# EAGLE board VideoBoy1.12 (EAGLE 8.2.2)
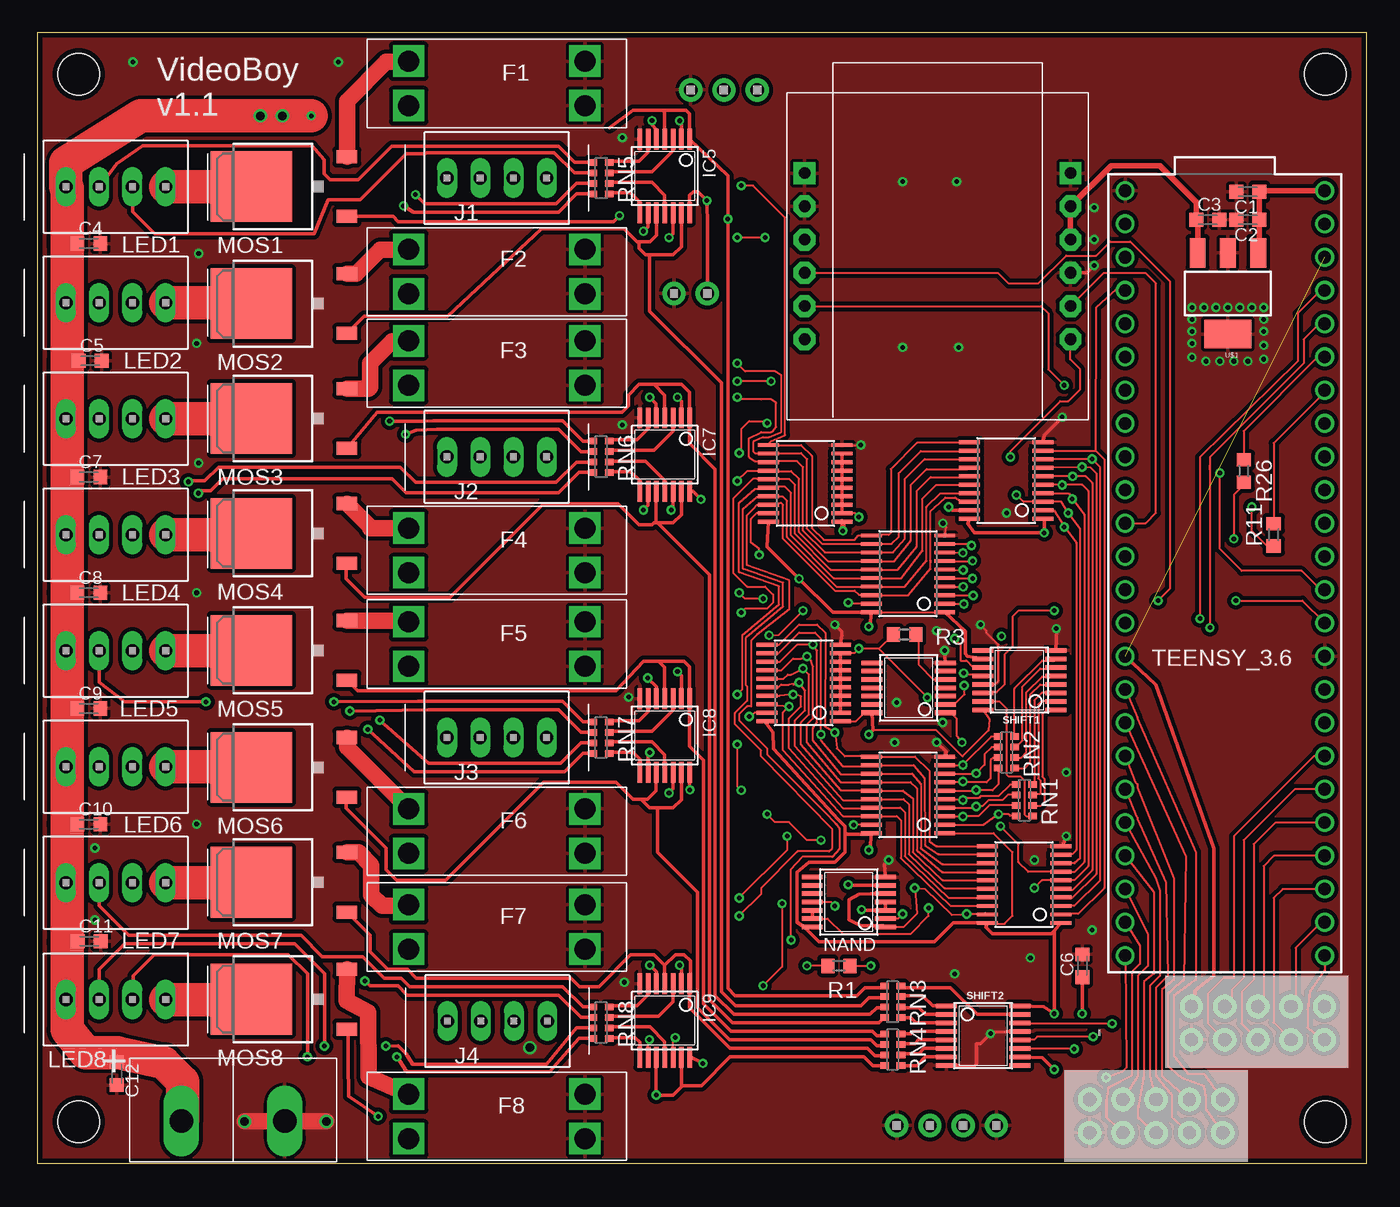
[diagram p2: board, top side]
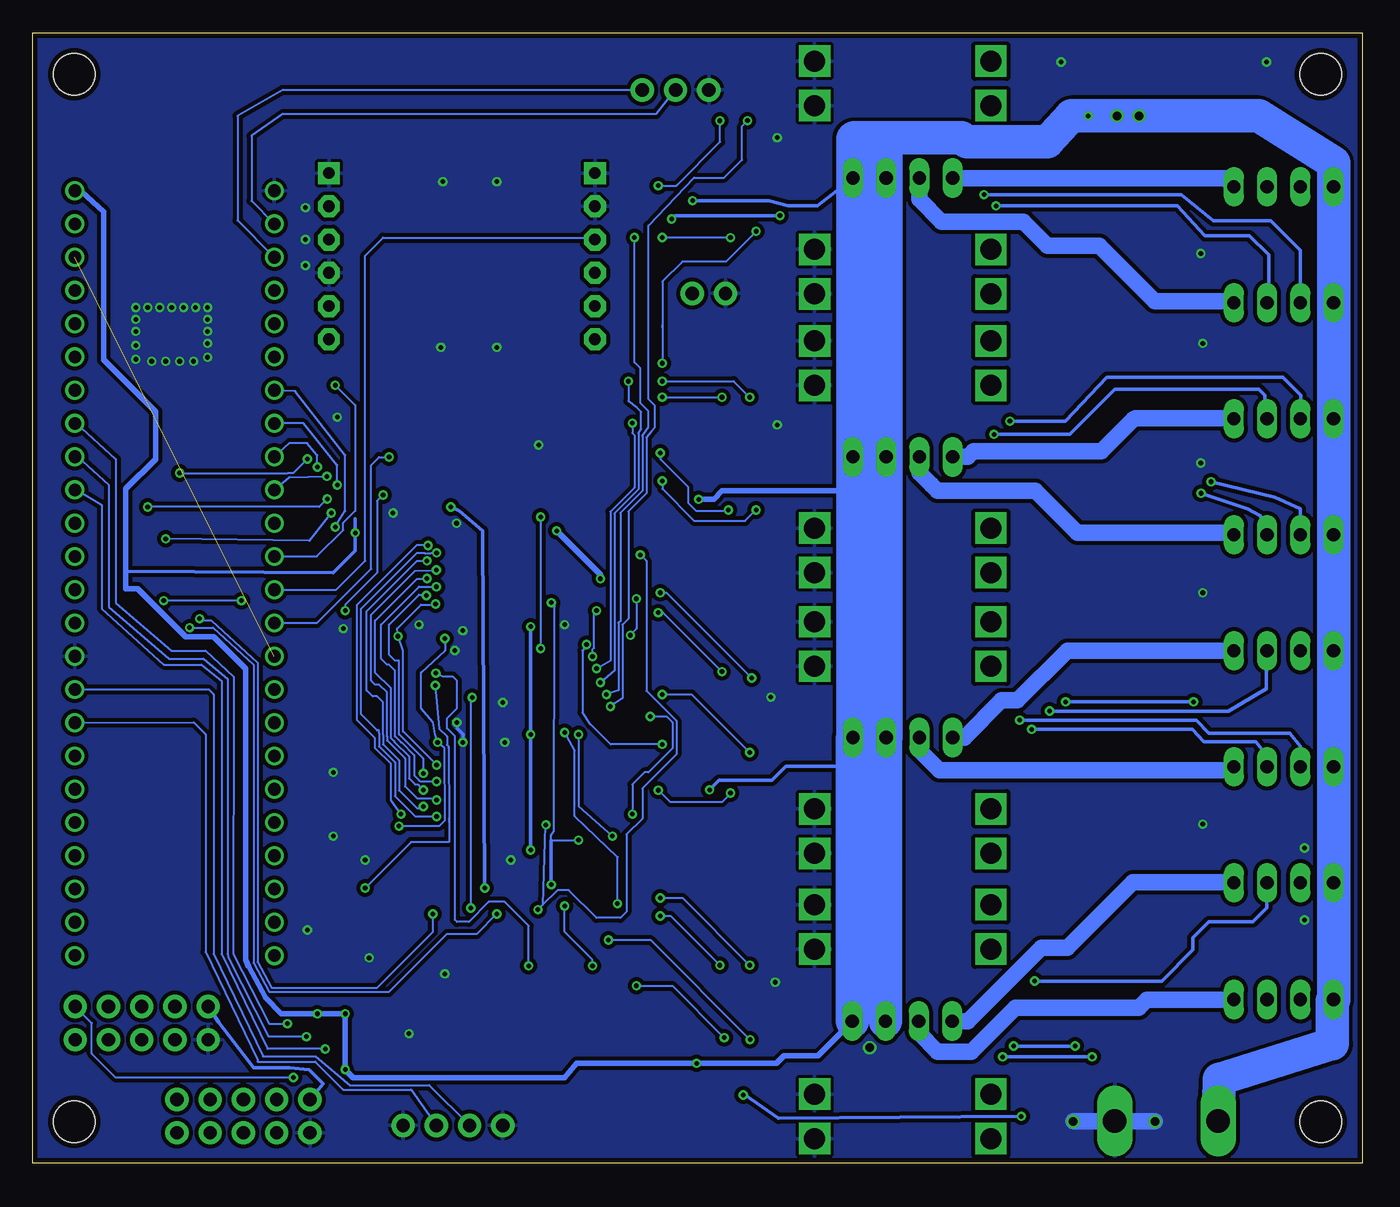
[diagram p3: board, bottom side, seen from below]

Size 101.6 x 86.36 mm. Coordinates in mm from the lower left corner, seen from the top.
Outline: 0,0 101.6,0 101.6,86.36 0,86.36 0,0
Copper layers (1*16): Top 0.0356mm / dielectric 1.5011mm / Bottom 0.0356mm
Design rules "oshpark-2layer": minimum track width 6mil, minimum drill 13mil, track to track 6mil, track to pad 6mil, pad to pad 6mil, via to via 6mil, smd to smd 6mil, copper to edge 15mil, drill to drill 6mil, minimum pad ring 7mil, minimum via ring 7mil, stop-mask expansion 2.5mil, vias tented up to drill 0mil, thermal gap 10mil
Holes 3.2 mm at 3.17,3.17 3.17,83.19 98.42,83.19 98.42,3.17

## Footprints (pad centres in the part's own frame; a part is rotated, then mirrored left to right if it is on the bottom)
C0603K = smd 1.05 x 1.08: 1 -0.875,0; 2 0.875,0
TSSOP20 = smd 0.3 x 1.6: 1 -2.925,-2.8; 2 -2.275,-2.8; 3 -1.625,-2.8; 4 -0.975,-2.8; 5 -0.325,-2.8; 6 0.325,-2.8; 7 0.975,-2.8; 8 1.625,-2.8; 9 2.275,-2.8; 10 2.925,-2.8; 11 2.925,2.8; 12 2.275,2.8; 13 1.625,2.8; 14 0.975,2.8; 15 0.325,2.8; 16 -0.325,2.8; 17 -0.975,2.8; 18 -1.625,2.8; 19 -2.275,2.8; 20 -2.925,2.8
3557 = drill 1.6 square: 1 -6.735,1.7; 2 -6.735,-1.7; 3 6.735,1.7; 4 6.735,-1.7
1X4 = drill 1.016 pad 1.778: 1 0,0; 2 2.54,0; 3 5.08,0; 4 7.62,0
1X3 = drill 1.016 pad 1.778: 1 0,0; 2 2.54,0; 3 5.08,0
1X2 = drill 1.016 pad 1.778: 1 0,0; 2 2.54,0
TSSOP14 = smd 0.35 x 1.6: 1 -1.905,-2.8; 2 -1.27,-2.8; 3 -0.635,-2.8; 4 0,-2.8; 5 0.635,-2.8; 6 1.27,-2.8; 7 1.905,-2.8; 8 1.905,2.8; 9 1.27,2.8; 10 0.635,2.8; 11 0,2.8; 12 -0.635,2.8; 13 -1.27,2.8; 14 -1.905,2.8
BOARDMOUNT-LED = drill 1.016 long: 1 3.81,0; 2 1.27,0; 3 -1.27,0; 4 -3.81,0
POWERPOLE_PAIR_25A = drill 1.8 long: BLACK 3.95,-0.85; RED -3.95,-0.85
2X5 = drill 1.016 pad 1.778: 1 0,0; 2 0,2.54; 3 2.54,0; 4 2.54,2.54; 5 5.08,0; 6 5.08,2.54; 7 7.62,0; 8 7.62,2.54; 9 10.16,0; 10 10.16,2.54
TO-252 = smd 1 x 1.6: 1 -2.28,-4.8; 2 2.28,-4.8 | smd 5.4 x 6.2: 3 0,2.5
R0603 = smd 1 x 1.1: 1 -0.85,0; 2 0.85,0
0603-ARV = smd 0.5 x 0.65: 1 -1.2,-0.625; 2 -0.4,-0.625; 3 0.4,-0.625; 4 1.2,-0.625; 5 1.2,0.625; 6 0.4,0.625; 7 -0.4,0.625; 8 -1.2,0.625
TSSOP16 = smd 0.35 x 1.6: 1 -2.275,-2.8; 2 -1.625,-2.8; 3 -0.975,-2.8; 4 -0.325,-2.8; 5 0.325,-2.8; 6 0.975,-2.8; 7 1.625,-2.8; 8 2.275,-2.8; 9 2.275,2.8; 10 1.625,2.8; 11 0.975,2.8; 12 0.325,2.8; 13 -0.325,2.8; 14 -0.975,2.8; 15 -1.625,2.8; 16 -2.275,2.8
TEENSY_3.5_DIL = drill 0.965: 0 -7.62,26.67; 1 -7.62,24.13; 2 -7.62,21.59; 3 -7.62,19.05; 3.3V 7.62,24.13; 3.3V3 -7.62,-6.35; 4 -7.62,16.51; 5 -7.62,13.97; 6 -7.62,11.43; 7 -7.62,8.89; 8 -7.62,6.35; 9 -7.62,3.81; 10 -7.62,1.27; 11 -7.62,-1.27; 12 -7.62,-3.81; 13 7.62,-3.81; 14/A0 7.62,-1.27; 15/A1 7.62,1.27; 16/A2 7.62,3.81; 17/A3 7.62,6.35; 18/A4 7.62,8.89; 19/A5 7.62,11.43; 20/A6 7.62,13.97; 21/A7 7.62,16.51; 22/A8 7.62,19.05; 23/A9 7.62,21.59; 24 -7.62,-8.89; 25 -7.62,-11.43; 26 -7.62,-13.97; 27 -7.62,-16.51; 28 -7.62,-19.05; 29 -7.62,-21.59; 30 -7.62,-24.13; 31/A12 -7.62,-26.67; 32/A13 -7.62,-29.21; 33/A14 7.62,-29.21; 34/A15 7.62,-26.67; 35/A16 7.62,-24.13; 36/A17 7.62,-21.59; 37/A18 7.62,-19.05; 38/A19 7.62,-16.51; 39/A20 7.62,-13.97; A21 7.62,-11.43; A22 7.62,-8.89; AGND 7.62,26.67; GND -7.62,29.21; GND1 7.62,-6.35; VIN 7.62,29.21
SOT223 = smd 1.219 x 2.235: 1 -2.311,-3.099; 2 0,-3.099; 3 2.311,-3.099 | smd 3.6 x 2.2: 4 0,3.099
WIZ820IO = drill 0.9 pad 1.676 square: J1.1 -10.16,6.35; J2.1 10.16,6.35 | drill 0.9 pad 1.676 octagon: J1.2 -10.16,3.81; J1.3 -10.16,1.27; J1.4 -10.16,-1.27; J1.5 -10.16,-3.81; J1.6 -10.16,-6.35; J2.2 10.16,3.81; J2.3 10.16,1.27; J2.4 10.16,-1.27; J2.5 10.16,-3.81; J2.6 10.16,-6.35

## Placement (x,y rotation side)
C1  [C0603K]  92.51,74.22 180 top
C2  [C0603K]  92.51,72.09 180 top
C3  [C0603K]  89.46,72.09 0 top
C4  [C0603K]  3.96,70.26 0 top
C5  [C0603K]  4.06,61.32 0 top
C6  [C0603K]  79.86,15.09 90 top
C7  [C0603K]  3.96,52.43 0 top
C8  [C0603K]  3.96,43.59 0 top
C9  [C0603K]  3.96,34.75 0 top
C10  [C0603K]  3.96,25.91 0 top
C11  [C0603K]  3.99,16.97 0 top
C12  [C0603K]  6.1,6.86 270 top
CLK-CLK  74245  [TSSOP20]  58.7,51.94 90 top
CLK-DATA  74245  [TSSOP20]  58.57,36.7 90 top
DATA-CLK  74245  [TSSOP20]  66.55,45.03 90 top
DATA-DATA  74245  [TSSOP20]  66.55,28.14 90 top
F1  FUSE_3557NOPIN2  [3557]  35.12,82.49 0 top
F2  FUSE_3557NOPIN2  [3557]  35.12,68.11 0 top
F3  FUSE_3557NOPIN2  [3557]  35.12,61.12 0 top
F4  FUSE_3557NOPIN2  [3557]  35.12,46.82 0 top
F5  FUSE_3557NOPIN2  [3557]  35.12,39.67 0 top
F6  FUSE_3557NOPIN2  [3557]  35.12,25.37 0 top
F7  FUSE_3557NOPIN2  [3557]  35.12,18.06 0 top
F8  FUSE_3557NOPIN2  [3557]  35.12,3.6 0 top
H1  1X4  [1X4]  73.3,2.9 180 top
H2  1X3  [1X3]  55.02,81.99 180 top
H3  1X2  [1X2]  51.21,66.45 180 top
IC5  74126PW  [TSSOP14]  47.96,75.42 180 top
IC6  74393AT-PWRQ1  [TSSOP14]  66.6,36.32 90 top
IC7  74126PW  [TSSOP14]  47.96,54.13 180 top
IC8  74126PW  [TSSOP14]  47.96,32.68 180 top
IC9  74126PW  [TSSOP14]  47.96,10.91 180 top
J1  [BOARDMOUNT-LED]  35.12,75.26 0 top
J2  [BOARDMOUNT-LED]  35.12,53.97 0 top
J3  [BOARDMOUNT-LED]  35.12,32.52 0 top
J4  [BOARDMOUNT-LED]  35.17,10.86 0 top
J5  POWERPOLE_POWER25A  [POWERPOLE_PAIR_25A]  14.97,4.08 0 top
JP1  2X5  [2X5]  90.58,4.88 180 top
JP2  2X5  [2X5]  98.35,11.99 180 top
LED1  [BOARDMOUNT-LED]  6.02,74.6 180 top
LED2  [BOARDMOUNT-LED]  6.02,65.74 180 top
LED3  [BOARDMOUNT-LED]  6.02,56.88 180 top
LED4  [BOARDMOUNT-LED]  6.02,48.02 180 top
LED5  [BOARDMOUNT-LED]  6.02,39.16 180 top
LED6  [BOARDMOUNT-LED]  6.02,30.3 180 top
LED7  [BOARDMOUNT-LED]  6.02,21.44 180 top
LED8  [BOARDMOUNT-LED]  6.02,12.52 180 top
MOS1  N-CHANNEL_MOSFET_TO-252  [TO-252]  18.87,74.61 90 top
MOS2  N-CHANNEL_MOSFET_TO-252  [TO-252]  18.87,65.67 90 top
MOS3  N-CHANNEL_MOSFET_TO-252  [TO-252]  18.87,56.9 90 top
MOS4  N-CHANNEL_MOSFET_TO-252  [TO-252]  18.87,48.12 90 top
MOS5  N-CHANNEL_MOSFET_TO-252  [TO-252]  18.87,39.18 90 top
MOS6  N-CHANNEL_MOSFET_TO-252  [TO-252]  18.87,30.25 90 top
MOS7  N-CHANNEL_MOSFET_TO-252  [TO-252]  18.87,21.47 90 top
MOS8  N-CHANNEL_MOSFET_TO-252  [TO-252]  18.87,12.53 90 top
NAND  74HC00PW  [TSSOP14]  62.03,19.96 90 top
OCTOCLK  74245  [TSSOP20]  74.04,52.15 90 top
OCTODATA  74245  [TSSOP20]  75.41,21.29 90 top
R1  30  [R0603]  61.26,15.09 0 top
R3  30  [R0603]  66.29,40.39 0 top
R11  30  [R0603]  94.49,48.01 90 top
R26  [R0603]  92.2,52.88 270 top
RN1  [0603-ARV]  75.44,27.74 90 top
RN2  [0603-ARV]  74.07,31.39 90 top
RN3  [0603-ARV]  65.38,12.34 90 top
RN4  [0603-ARV]  65.38,8.69 90 top
RN5  [0603-ARV]  43.08,75.26 90 top
RN6  [0603-ARV]  43.08,53.97 90 top
RN7  [0603-ARV]  43.08,32.52 90 top
RN8  [0603-ARV]  43.08,10.75 90 top
SHIFT1  [TSSOP16]  75.06,36.91 90 top
SHIFT2  [TSSOP16]  72.29,9.75 270 top
TEENSY_3.6  TEENSY_3.5_DIL  [TEENSY_3.5_DIL]  90.75,45.09 0 top
U$1  3.3VREGMCP1825  [SOT223]  90.98,66.45 180 top
WIZNET820IO  [WIZ820IO]  68.81,69.29 0 top

## Tracks (layer width: path | path; a pad name or v marks a point on that pad's centre or on a via)
20_OUT
  Top 0.152: TEENSY_3.6.20/A6 98.37,58.9 94.49,55.02 R11.2
21_OUT
  Top 0.152: TEENSY_3.6.21/A7 97.87,61.6 92.2,55.93 R26.1
24
  Top 0.152: TEENSY_3.6.24 84.06,34.08 84.09,34.05 84.09,34.01 88.54,23.77 88.54,14.02 86.87,12.8 86.87,8.23 87.94,6.86 89.15,6.86 JP1.1
25
  Top 0.152: TEENSY_3.6.25 87.78,23.47 87.63,14.02 86.41,12.95 86.41,7.47 87.48,6.55 89.15,5.94 89.31,5.03 89.31,4.11 JP1.2
26
  Top 0.152: TEENSY_3.6.26 83.93,29.13 84.09,28.97 84.09,28.74 86.87,21.79 86.87,14.02 85.95,13.26 85.95,6.71 JP1.3
27
  Top 0.152: TEENSY_3.6.27 84,26.52 84.09,26.43 84.09,26.3 86.26,21.49 86.41,14.33 85.5,13.41 85.5,6.71 86.49,5.46 86.61,5.34 86.61,5.31 86.72,5.18 86.72,3.51 JP1.4
28
  Top 0.152: TEENSY_3.6.28 85.5,21.79 85.8,20.88 85.8,14.33 85.04,13.56 85.04,6.71 JP1.5
29
  Top 0.152: TEENSY_3.6.29 85.34,20.73 85.34,14.48 84.58,13.87 84.58,6.71 84.12,4.11 84.12,3.51 JP1.6
30
  Top 0.152: TEENSY_3.6.30 84.89,17.53 84.89,15.09 84.12,14.33 84.12,6.71 JP1.7
31
  Top 0.152: TEENSY_3.6.31/A12 84.28,16.61 84.28,15.24 83.67,14.63 83.67,6.71 81.84,5.79 81.69,4.88 81.69,3.51 JP1.8
32  (via drill 0.35)
  Top 0.152: TEENSY_3.6.32/A13 83.21,7.32 82.91,7.01 v81.69,6.55
  Bottom 0.152: v81.69,6.55 95.25,6.55 97.08,8.38 97.08,10.72 JP2.1
33
  Top 0.152: TEENSY_3.6.33/A14 98.37,14.78 | 98.37,14.78 98.37,14.71 | 98.37,14.78 97.23,13.11 97.08,11.73 97.08,10.36 JP2.2
33REG
  Top 0.406: WIZNET820IO.J2.3 WIZNET820IO.J2.2 82.07,76.2 85.8,76.2 88.58,73.42 C3.1 88.67,72 U$1.3
34
  Top 0.152: TEENSY_3.6.34/A15 98.12,18.42 96.16,16.46 96.16,12.34 JP2.3
35
  Top 0.152: TEENSY_3.6.35/A16 95.17,20.96 94.49,20.27 94.49,10.77 JP2.4
36
  Top 0.152: TEENSY_3.6.36/A17 94.51,23.5 93.73,22.71 93.73,12.45 JP2.5
37
  Top 0.152: TEENSY_3.6.37/A18 94.61,26.04 92.96,24.38 92.96,14.02 92.05,13.11 92.05,10.67 JP2.6
38
  Top 0.152: TEENSY_3.6.38/A19 96.09,28.58 92.2,24.69 92.2,14.17 91.29,13.26 91.29,12.55 JP2.7
39
  Top 0.152: TEENSY_3.6.39/A20 97.56,31.12 91.44,24.99 91.44,14.17 90.68,14.17 89.46,12.95 89.46,10.72 JP2.8
+3V3  (1 unrouted)
  Top 0.254: TEENSY_3.6.3.3V3 85.5,36.58 89.92,24.08 89.92,14.33 88.54,13.26 JP2.9
  Bottom 0.254: JP1.9 79.4,6.1 80.47,7.16 81.97,7.32 84.73,7.32 87.4,10.8 JP2.9
C1  (via drill 0.35)
  Top 0.152: 55.79,54.86 58.37,54.86 59.19,54.04 59.19,48.53 60.11,47.61 62.48,47.61 62.72,47.96 62.73,47.96 DATA-CLK.11 63.68,48.01 65.08,48.01 65.23,48.16 65.23,53.04 67.26,55.07 OCTOCLK.11 | 55.79,54.86 56.08,55.16 57.15,55.63 57.15,72.24 54.71,74.68 v53.8,74.68 | CLK-CLK.11 55.79,54.86
  Top 0.254: IC5.2 49.23,79.35 v49.09,79.64
  Bottom 0.152: v53.8,74.68 52.43,74.68 49.07,78.03 49.07,79.46 v49.09,79.64
C2  (via drill 0.35)
  Top 0.152: 55.82,54.25 58.37,54.25 58.83,53.8 58.83,48.46 59.98,47.31 DATA-CLK.12 65.29,47.31 65.84,47.85 65.84,52.73 67.51,54.41 71.11,54.41 OCTOCLK.12 | 55.82,54.25 CLK-CLK.12 | 55.82,54.25 54.86,54.25 54.71,54.41 54.71,55.12 54.76,55.17 55.47,55.47 55.93,55.47 56.82,55.83 56.84,60.2 56.39,60.5 54.1,60.5 v53.49,61.11
  Top 0.254: IC5.9 46.69,71.55 v46.33,71.2
  Bottom 0.152: 53.49,63.85 v53.49,61.11 | 53.49,63.85 53.49,64.04 | v46.33,71.2 46.33,71.17 48.62,68.88 51.97,68.88 53.49,67.36 53.49,63.85
C3  (via drill 0.35)
  Top 0.152: OCTOCLK.13 71.1,53.8 67.82,53.8 66.29,52.27 66.29,47.7 65.4,46.66 DATA-CLK.13 60.2,46.66 58.52,48.34 58.52,53.19 58.06,53.64 55.86,53.64 CLK-CLK.13 55.7,53.64 54.86,53.64 54.41,53.95 54.41,55.4 55.35,55.85 56.06,55.85 56.22,55.92 56.46,56.24 56.46,58.09 56.08,58.37 55.33,58.37 55.33,58.36 55.32,58.37 53.65,58.37 v53.49,58.52
  Top 0.254: IC7.2 49.23,58.23 v48.93,58.52
  Bottom 0.152: v53.49,58.52 v48.93,58.52
C4  (via drill 0.35)
  Top 0.152: 55.75,52.88 CLK-CLK.14 55.82,52.88 | 55.82,52.88 57.61,52.88 58.22,52.27 58.22,48.21 60.42,46.01 DATA-CLK.14 65.52,46.01 66.75,47.55 66.75,51.82 67.97,53.04 71.04,53.04 OCTOCLK.14 | v53.49,52.12 54.25,52.88 55.82,52.88
  Top 0.254: IC7.9 46.69,50.26 v46.33,49.91
  Bottom 0.152: v53.49,52.12 53.49,51.51 51.05,49.07 47.17,49.07 v46.33,49.91
C5  (via drill 0.35)
  Top 0.152: CLK-CLK.15 55.78,52.27 55.17,52.27 55.02,52.27 54.71,52.27 53.19,50.75 53.19,45.11 54.25,44.04 55.63,44.04 56.24,43.43 56.24,42.82 55.78,42.37 54.1,42.37 v53.8,42.06 | 55.79,52.27 CLK-CLK.15 57.45,52.27 57.91,51.82 57.91,48.08 60.64,45.36 DATA-CLK.15 65.78,45.36 67.21,47.09 67.21,51.36 68.28,52.43 71.08,52.43 OCTOCLK.15
  Top 0.254: 55.17,52.27 CLK-CLK.15 | IC8.2 49.23,37.26 v48.93,37.56
  Bottom 0.152: v53.8,42.06 53.44,42.06 v48.93,37.56
C6  (via drill 0.35)
  Top 0.152: OCTOCLK.16 71.12,51.82 68.73,51.82 67.67,50.77 67.67,46.79 66.05,44.71 DATA-CLK.16 60.86,44.71 57.61,47.96 57.61,51.21 57.15,51.66 55.83,51.66 CLK-CLK.16 55.68,51.51 54.86,51.51 53.65,50.44 53.65,45.14 56.69,44.07 56.69,42.67 53.86,40.3 53.86,36.19 v53.49,35.81
  Top 0.254: IC8.9 46.69,31.25 v46.82,31.38
  Bottom 0.152: v53.49,35.81 51.25,35.81 v46.82,31.38
C7  (via drill 0.35)
  Top 0.152: OCTOCLK.17 69.04,51.18 67.97,50.14 67.97,46.02 66.31,44.06 DATA-CLK.17 61.08,44.06 57.3,47.83 57.3,50.6 57,50.9 55.85,50.9 CLK-CLK.17 55.72,50.9 55.02,50.9 53.95,49.99 53.95,45.42 57,44.35 57,42.52 54.17,40.15 54.17,36.52 54.25,36.43 54.25,35.33 53.34,34.42 53.34,33.53 55.32,31.55 55.32,31.09 60.76,25.5 60.76,24.08 60.5,23.83 58.12,23.83 55.32,21.03 55.32,20.57 v53.65,18.9
  Top 0.254: IC9.2 49.23,15 v49.09,15.13
  Bottom 0.152: v53.65,18.9 52.86,18.9 v49.09,15.13
C8  (via drill 0.35)
  Top 0.152: CLK-CLK.18 55.76,50.29 55.02,50.29 54.7,49.98 54.25,49.52 54.25,45.69 57.48,44.53 57.48,42.34 55.01,40.38 54.56,39.93 54.56,34.9 54.25,34.9 53.65,34.29 53.65,33.83 55.78,31.7 55.78,31.24 60.34,26.68 60.84,26.14 60.94,26.04 61.03,25.94 61.04,25.94 61.29,25.56 61.29,24.03 60.76,23.42 58.48,23.42 57.58,22.42 57.58,17.09 v57.61,17.07 | 55.81,50.29 CLK-CLK.18 | 68.59,50.13 68.28,49.82 68.28,46.04 68.28,45.92 68.28,45.91 68.28,45.42 66.57,43.41 DATA-CLK.18 63.61,43.43 62.79,43.43 62.47,43.75 60.95,43.75 57,47.71 57,50.29 56.84,50.44 56.54,50.29 CLK-CLK.18 | 68.59,50.13 | 68.59,50.13 69.39,50.85 70.15,50.85 70.56,50.6 71.05,50.6 OCTOCLK.18 | IC9.9 46.69,9.35 v46.79,9.45
  Bottom 0.152: v57.61,17.07 54.41,17.07 v46.79,9.45
COUT_1
  Top 0.254: RN5.6 41.06,75.66 39.51,77.21 29.76,77.21 29.66,77.11 28.19,77.11 24.69,73.61 22.25,73.61 21.18,71.02 8.99,71.02 7.32,72.69 7.32,74.57 LED1.3
COUT_2  (via drill 0.35)
  Top 0.254: v28,73.14 28.78,72.66 39.83,72.66 41.23,74.06 RN5.8
  Bottom 0.254: v28,73.14 14.16,73.14 12.05,70.87 8.63,70.87 7.17,69.41 7.17,65.85 LED2.3
COUT_3  (via drill 0.35)
  Top 0.254: v28.15,55.69 28.96,55.99 30.57,56.08 39.83,56.08 41.55,54.37 RN6.6
  Bottom 0.254: v28.15,55.69 22.34,55.69 18.9,59.13 7.92,59.13 7.47,58.67 7.47,57.06 LED3.3
COUT_4  (via drill 0.35)
  Top 0.254: RN6.8 41.4,52.77 39.83,51.21 28.19,51.21 27.13,52.27 14.17,52.27 13.26,51.36 12.5,51.36 v12.33,51.19
  Bottom 0.254: v12.33,51.19 8.8,50.02 7.79,49.46 7.33,48.06 LED4.3
COUT_5  (via drill 0.35)
  Top 0.254: RN7.6 41.55,32.92 39.83,34.63 29.92,34.63 v23.9,34.55
  Bottom 0.254: v23.9,34.55 10.26,34.55 7.33,36.26 7.33,39.11 LED5.3
COUT_6  (via drill 0.35)
  Top 0.254: RN7.8 41.72,31.32 40.32,29.92 28.8,29.92 v25.27,33.15
  Bottom 0.254: v25.27,33.15 12.99,33.15 12.11,32.21 8.16,32.21 7.33,31.22 7.33,30.34 LED6.3
COUT_7  (via drill 0.35)
  Top 0.254: RN8.6 41.55,11.15 39.83,12.86 28.29,12.86 27.58,13.56 25.45,13.56 v25.04,13.92
  Bottom 0.254: LED7.3 7.32,21.41 7.32,19.51 8.38,18.44 11.73,18.44 12.95,17.22 12.95,16.31 15.34,13.92 v25.04,13.92
COUT_8  (via drill 0.35)
  Top 0.254: RN8.8 41.4,9.55 39.16,7.01 28.22,7.01 v27.49,8.14 | v20.66,8.14 20.66,14.48 19.2,15.95 8.96,15.95 7.33,14.32 7.33,12.56 LED8.3
  Bottom 0.254: v27.49,8.14 v20.66,8.14
CROUT9
  Top 0.254: IC5.3 48.59,77.36 46.98,75.75 43.8,75.75 RN5.3
CROUT10
  Top 0.254: IC5.8 46.05,73.43 45.36,74.12 43.77,74.12 RN5.1
CROUT11
  Top 0.254: IC7.3 48.59,55.91 47.15,54.46 43.8,54.46 RN6.3
CROUT12
  Top 0.254: IC7.8 46.05,52.14 45.36,52.83 43.77,52.83 RN6.1
CROUT13
  Top 0.254: IC9.3 48.59,12.36 47.47,11.23 43.8,11.23 RN8.3
CROUT14
  Top 0.254: IC8.8 46.05,30.85 45.52,31.38 43.77,31.38 RN7.1
CROUT15
  Top 0.254: IC9.8 46.05,9.24 45.68,9.61 43.77,9.61 RN8.1
CROUT16
  Top 0.254: IC8.3 48.59,34.62 46.98,33.01 43.8,33.01 RN7.3
D1  (via drill 0.35)
  Top 0.152: OCTODATA.18 72.49,19.66 69.8,19.66 65.99,23.32 65.99,26.21 65.68,26.52 DATA-DATA.18 63.63,26.52 61.57,26.52 57,31.55 57,34.44 v57.45,34.9 CLK-DATA.18
  Top 0.254: v46.98,79.65 46.98,79.32 47.31,79 47.31,78.24 IC5.5
  Bottom 0.152: v57.45,34.9 56.54,35.51 56.54,41.15 56.08,41.61 56.08,49.81 54.71,51.18 54.71,55.45 | 54.71,55.45 54.36,55.88 54.05,56.24 54.05,57.86 54.56,58.37 54.56,71.63 51.05,75.29 48.77,75.29 47.4,76.66 47.4,79.23 v46.98,79.65 | 54.71,55.45
D2  (via drill 0.35)
  Top 0.152: OCTODATA.17 72.45,20.27 69.65,20.27 66.29,23.47 66.29,26.82 65.95,27.17 DATA-DATA.17 63.59,27.13 61.57,27.13 57.45,31.7 57.45,33.99 58.37,34.9 58.37,35.66 v57.76,35.81 56.76,35.73 CLK-DATA.17 | v55.63,70.71 v53.49,70.71
  Top 0.254: IC5.12 48.59,71.02 v48.28,70.71
  Bottom 0.152: v57.76,35.81 56.84,36.12 56.84,41.27 56.69,41.43 56.69,49.68 55.02,51.36 55.02,55.57 54.56,56.24 54.56,57.45 54.58,57.48 55.17,58.06 55.17,60.72 55.63,61.17 v55.63,70.71 | v48.28,70.71 v53.49,70.71
D3  (via drill 0.35)
  Top 0.152: OCTODATA.16 72.42,21.03 69.34,21.03 66.6,23.62 66.6,27.43 66.21,27.82 DATA-DATA.16 63.55,27.74 61.57,27.74 57.91,31.85 57.91,33.83 58.67,34.59 58.67,36.12 v58.22,36.73 | CLK-DATA.16 56.65,36.38 56.84,36.58 57.45,36.58 v58.22,36.73 | 57.76,36.58 v58.22,36.73 | v56.08,59.74 v53.49,59.74
  Top 0.254: v46.82,58.52 47.31,58.03 47.31,56.95 IC7.5
  Bottom 0.152: v56.08,59.74 56.08,58.22 55.44,57.73 55.12,57.41 55.12,56.08 55.32,55.75 55.32,51.49 57.15,49.66 57.15,37.64 v58.22,36.73 | v53.49,59.74 48.04,59.74 v46.82,58.52
D4  (via drill 0.35)
  Top 0.152: OCTODATA.15 72.46,21.64 69.19,21.64 66.9,23.77 66.9,27.89 66.17,28.47 DATA-DATA.15 63.6,28.5 61.42,28.5 58.37,32 58.37,33.68 58.98,34.29 58.98,37.34 v58.52,37.8 | v58.52,37.8 58.22,37.64 | CLK-DATA.15 57.05,37.03 57.36,37.34 57.6,37.34 v58.52,37.8 | v55.78,56.54 55.63,56.69 54.41,56.69 53.8,56.08 53.8,54.41 v53.65,54.25
  Top 0.254: IC7.12 48.59,50.06 v48.45,49.91
  Bottom 0.152: v55.78,56.54 55.78,55.78 55.63,55.63 55.63,51.61 57.45,49.78 57.45,38.4 v58.52,37.8 | v53.65,54.25 53.65,53.8 51.51,51.66 51.51,50.44 50.9,49.83 48.52,49.83 v48.45,49.91
D5  (via drill 0.35)
  Top 0.152: OCTODATA.14 72.48,22.25 69.19,22.25 67.21,23.93 67.21,28.65 66.74,29.12 DATA-DATA.14 63.62,29.11 61.42,29.11 58.83,32.16 58.83,33.53 59.28,33.99 59.28,37.95 59.13,38.4 v58.83,38.71 58.37,38.56 57.76,38.56 56.88,37.68 CLK-DATA.14 | v55.93,40.34 56.69,40.39 v58.52,42.21 | v55.47,43.13 54.1,43.13 v53.65,43.59
  Top 0.254: IC8.5 47.32,36.41 v46.66,37.07
  Bottom 0.152: v55.47,43.13 55.47,40.84 v55.93,40.34 | v58.83,38.71 58.83,39.26 58.7,39.38 58.7,42.03 v58.52,42.21 | v53.65,43.59 53.17,43.59 v46.66,37.07
D6  (via drill 0.35)
  Top 0.152: OCTODATA.13 72.45,22.86 69.19,22.86 67.51,24.08 67.51,28.96 66.85,29.77 DATA-DATA.13 63.58,29.72 61.42,29.72 59.28,32.31 59.28,33.22 59.59,33.68 59.59,39.17 v59.28,39.62 58.06,39.62 56.77,38.33 CLK-DATA.13 | v53.49,32 53.49,28.8 v53.8,28.5
  Top 0.254: IC8.12 48.59,28.61 v48.28,28.3
  Bottom 0.152: v59.28,39.62 59.59,39.17 59.59,34.44 59.02,33.59 | 59.02,33.59 58.98,33.53 | 59.02,33.59 57.43,32 v53.49,32 | v48.28,28.3 48.28,28.22 48.92,27.58 52.88,27.58 v53.8,28.5
D7  (via drill 0.35)
  Top 0.152: OCTODATA.12 72.43,23.62 68.89,23.62 67.84,24.31 67.82,29.41 66.97,30.42 DATA-DATA.12 63.54,30.33 61.57,30.33 59.89,32.31 v59.89,32.77 59.89,40.08 59.44,40.54 58.22,40.54 56.66,38.98 CLK-DATA.12 | v57.3,24.99 57.3,23.93 v53.65,20.27
  Top 0.254: IC9.5 47.32,14.63 v46.82,15.13
  Bottom 0.152: v59.89,32.77 59.89,27.28 v57.3,24.99 | v53.65,20.27 51.96,20.27 v46.82,15.13
D8  (via drill 0.35)
  Top 0.152: OCTODATA.11 72.47,24.23 68.73,24.23 68.2,24.59 68.2,29.97 67.08,31.07 DATA-DATA.11 63.61,31.09 61.72,31.09 61.11,31.7 v60.96,32.92 60.2,33.38 60.22,40.51 59.59,41.15 58.22,41.15 56.7,39.63 CLK-DATA.11 | IC9.12 48.59,9.43 v48.77,9.6 | v56.92,19.84 56.92,15.01 v55.47,13.56
  Bottom 0.152: v56.92,19.84 56.9,23.39 60.2,26.52 60.2,31.55 v60.96,32.92 | v55.47,13.56 52.73,13.56 v48.77,9.6
DAC0
  Bottom 0.152: TEENSY_3.6.A21 89.31,33.68 88.39,32.77 88.39,16.15 84.43,7.92 84.43,7.77 80.01,7.77 77.88,5.64 72.7,5.64 H1.2
DAC1
  Bottom 0.152: TEENSY_3.6.A22 88.16,36.2 87.78,35.81 87.78,16 84,8.18 79.97,8.18 77.35,5.97 71.3,5.97 H1.3
DOUT_1
  Top 0.254: RN5.5 41.07,76.46 39.83,77.7 27.1,77.7 24.54,75.13 22.4,75.13 21.95,75.59 21.95,76.66 21.03,77.72 8.08,77.72 6.1,76.35 4.88,74.73 LED1.2
DOUT_2  (via drill 0.35)
  Top 0.254: v28.91,73.99 29.6,73.31 39.67,73.31 41.22,74.86 RN5.7
  Bottom 0.254: v28.91,73.99 13.83,73.99 11.39,72.01 7.01,72.01 4.73,69.73 4.73,65.75 LED2.2
DOUT_3  (via drill 0.35)
  Top 0.254: v26.93,56.69 29.44,56.69 30.25,56.73 40.16,56.73 41.72,55.17 RN6.5
  Bottom 0.254: v26.93,56.69 22.71,56.69 19.51,60.05 6.1,60.05 4.72,58.67 4.72,56.9 LED3.2
DOUT_4  (via drill 0.35)
  Top 0.254: RN6.7 41.22,53.57 39.67,52.02 28.9,52.02 27.74,53.19 13.87,53.19 12.8,52.12 11.62,52.12 v11.57,52.07
  Bottom 0.254: v11.57,52.07 6.68,50.87 4.73,49.99 4.73,48.03 LED4.2
DOUT_5  (via drill 0.35)
  Top 0.254: RN7.5 41.72,33.72 40.16,35.28 29.11,35.28 v22.68,35.25 | v12.9,35.25 6.68,35.25 4.73,36.75 4.73,39.14 LED5.2
  Bottom 0.254: v22.68,35.25 v12.9,35.25
DOUT_6  (via drill 0.35)
  Top 0.254: RN7.7 41.55,32.12 39.99,30.57 29.92,30.57 v26.18,33.85
  Bottom 0.254: v26.18,33.85 12.7,33.85 11.73,32.85 5.54,32.85 4.73,31.87 4.73,30.31 LED6.2
DOUT_7
  Top 0.254: RN8.5 41.72,11.95 40.16,13.51 28.46,13.51 27.81,14.16 26.51,14.16 24.88,15.78 21.8,15.78 20.17,17.41 7.01,17.41 4.75,19.67 LED7.2
DOUT_8  (via drill 0.35)
  Top 0.254: RN8.7 41.22,10.35 38.92,7.59 28.69,7.59 28.19,8.38 27.6,8.99 v26.65,8.96 | v21.96,8.96 21.96,14.48 19.68,16.76 6.68,16.76 4.73,14.81 4.73,12.53 LED8.2
  Bottom 0.254: v26.65,8.96 v21.96,8.96
DRAIN1
  Top 2.54: LED1.4 16.2,74.6 MOS1.3
  Bottom 1.27: J1.4 10.49,75.26 LED1.4
DRAIN2
  Top 2.54: LED2.4 16.63,65.74 MOS2.3
  Bottom 1.27: J1.3 33.85,73.63 32.16,71.93 25.91,71.93 24.08,70.1 20.12,70.1 15.85,65.84 9.93,65.84 LED2.4
DRAIN3
  Top 2.54: LED3.4 16.35,56.88 MOS3.3
  Bottom 1.27: J2.4 30.16,53.97 29.72,54.41 19.96,54.41 17.52,56.85 17.35,56.9 9.85,56.9 LED3.4
DRAIN4
  Top 2.54: LED4.4 16.27,48.02 MOS4.3
  Bottom 1.27: J2.3 33.85,52.75 32.92,51.82 32.46,51.36 24.99,51.36 21.79,48.16 9.97,48.16 LED4.4
DRAIN5
  Top 2.54: LED5.4 16.34,39.16 MOS5.3
  Bottom 1.27: J3.4 30.42,32.52 27.58,35.36 26.37,35.36 22.55,39.17 9.84,39.17 LED5.4
DRAIN6
  Top 2.54: LED6.4 16.32,30.3 MOS6.3
  Bottom 1.27: J3.3 33.85,31.56 32.31,30.02 10.1,30.02 LED6.4
DRAIN7
  Top 2.54: LED7.4 16.34,21.44 MOS7.3
  Bottom 1.27: J4.4 30.13,10.86 24.54,16.46 22.55,16.46 17.53,21.49 9.88,21.49 LED7.4
DRAIN8
  Top 2.54: LED8.4 16.35,12.52 MOS8.3
  Bottom 1.27: J4.3 33.9,9.97 32.46,8.53 29.87,8.53 26.52,11.89 17.07,11.89 16.46,12.5 9.84,12.5 LED8.4
DROUT9
  Top 0.254: IC5.6 46.69,77.24 46.01,76.56 43.81,76.56 RN5.4
DROUT10
  Top 0.254: IC5.11 47.96,73.96 46.98,74.93 43.78,74.93 RN5.2
DROUT11
  Top 0.254: IC7.6 46.69,56.11 45.84,55.27 43.81,55.27 RN6.4
DROUT12
  Top 0.254: IC7.11 47.96,52.18 46.49,53.65 43.78,53.65 RN6.2
DROUT13
  Top 0.254: IC9.6 46.69,12.89 45.84,12.05 43.81,12.05 RN8.4
DROUT14
  Top 0.254: IC8.11 47.96,31.22 46.98,32.2 43.78,32.2 RN7.2
DROUT15
  Top 0.254: IC9.11 47.96,9.28 46.82,10.42 43.78,10.42 RN8.2
DROUT16
  Top 0.254: IC8.6 46.69,34.5 46.01,33.82 43.81,33.82 RN7.4
EN1  (via drill 0.35)
  Top 0.254: 43.72,79.12 45.52,80.46 47.8,80.46 | 47.8,80.46 47.96,80.3 IC5.4 | 47.8,80.46 49.58,80.46 49.86,80.18 IC5.1 52.78,75.45 v52.78,72.13 52.78,13.36 53.34,12.8 62.64,12.8 63.25,13.41 64.62,13.41 RN3.5 | MOS1.1 27.19,72.33 27.58,71.93 44.04,71.93 v44.5,72.39
  Bottom 0.254: v44.5,72.39 52.52,72.39 v52.78,72.13
EN1R
  Top 0.152: 75.29,11.28 SHIFT2.15
  Top 0.254: SHIFT2.15 71.83,11.38 69.8,13.41 66.14,13.41 RN3.4
EN2
  Top 0.254: 47.31,72.61 IC5.10 47.32,70.89 46.82,70.38 46.02,70.38 | 46.02,70.38 45.84,70.38 44.84,71.39 38.53,71.39 31.38,64.7 24.98,64.7 MOS2.1 | IC5.13 49.23,70.03 48.61,69.41 46.81,69.41 | 46.02,70.38 46.01,70.37 46.01,69.9 46.49,69.41 46.81,69.41 | 46.81,69.41 46.79,69.38 46.79,65.07 52.3,59.61 52.3,13.11 53.35,12.03 62.93,12.03 63.55,12.65 64.66,12.65 RN3.6
EN2R
  Top 0.152: 69.43,11.99 SHIFT2.1
  Top 0.254: SHIFT2.1 68.44,12.03 67.67,12.8 66.06,12.8 RN3.3
EN3
  Top 0.254: IC7.4 47.96,58.68 47.15,59.5 | 47.15,59.5 46.01,59.5 45.2,58.68 45.2,57.87 44.71,57.38 25.98,57.38 MOS3.1 | 49.86,57.04 IC7.1 | 49.86,57.04 49.86,58.89 49.26,59.5 47.15,59.5 | 49.86,57.04 49.84,57.01 49.84,55.02 51.82,53.04 51.82,12.8 53.24,11.38 63.65,11.38 64.16,11.89 64.7,11.89 RN3.7
EN3R
  Top 0.254: SHIFT2.2 67.87,11.38 67.36,11.89 66.06,11.89 RN3.2
EN4
  Top 0.254: IC7.10 47.31,51.32 47.31,49.01 47.39,48.93 | IC7.13 49.23,49.55 48.61,48.93 47.39,48.93 | 47.39,48.93 47.15,48.93 46.98,48.77 46.01,48.77 44.38,50.4 38.7,50.4 31.55,43.25 25.03,43.25 23.62,44.65 23.62,45.79 MOS4.1 | 47.39,48.93 51.36,44.96 51.36,12.5 53.13,10.73 64.34,10.73 RN3.8
EN4R
  Top 0.152: 69.43,10.67 SHIFT2.3
  Top 0.254: SHIFT2.3 67.15,10.73 66.75,11.13 66.02,11.13 RN3.1
EN5
  Top 0.254: 27.64,36.1 27.74,36.1 | 27.74,36.1 44.22,36.1 46.33,38.37 47.47,38.37 | 47.47,38.37 47.96,37.88 IC8.4 | 47.47,38.37 49.42,38.37 49.86,37.93 IC8.1 49.84,35.45 49.84,31.85 50.9,30.78 50.9,12.19 53.02,10.08 63.84,10.08 64.16,9.75 64.62,9.75 RN4.5 | 27.74,36.1 24.48,36.1 MOS5.1
EN5R
  Top 0.254: SHIFT2.4 66.92,10.08 66.75,9.91 66.02,9.91 RN4.4
EN6
  Top 0.254: 46.13,27.81 45.52,27.81 44.22,29.11 38.7,29.11 31.22,21.63 27.48,21.63 26.67,22.45 26.67,24.08 23.62,27.13 23.62,27.92 MOS6.1 | 46.13,27.81 46.66,27.81 47.31,28.46 47.31,29.87 IC8.10 | IC8.13 49.23,27.78 48.61,27.16 47.31,27.16 | 47.31,27.16 46.78,27.16 46.13,27.81 | 47.31,27.16 47.4,27.07 47.4,23.77 50.44,20.73 50.44,11.89 52.9,9.43 63.72,9.43 64.16,8.99 64.66,8.99 RN4.6
EN6R
  Top 0.152: 69.43,9.37 SHIFT2.5
  Top 0.254: SHIFT2.5 67.34,9.43 67.06,9.14 66.06,9.14 RN4.3
EN7
  Top 0.254: 47.96,15.13 47.15,15.95 45.36,15.95 42.92,13.51 41.46,13.51 40.81,14.16 28.95,14.16 28.3,14.81 26.8,14.81 25.45,16.15 25.45,17.41 MOS7.1 | 47.96,15.13 IC9.4 | 47.96,15.13 48.77,15.95 49.42,15.95 49.91,15.46 49.91,13.75 IC9.1 49.84,13.68 49.84,11.89 52.94,8.78 63.46,8.78 64.01,8.23 64.7,8.23 RN4.7
EN7R
  Top 0.152: 69.4,8.69 SHIFT2.6
  Top 0.254: SHIFT2.6 67.76,8.78 67.36,8.38 66.1,8.38 RN4.2
EN8  (via drill 0.35)
  Top 0.254: 47.31,5.26 47.31,8.09 IC9.10 | 47.31,5.26 v47.31,5.22 | 47.31,5.26 47.35,5.22 48.61,5.22 49.23,5.84 49.23,5.9 | 49.23,5.9 IC9.13 | 49.23,5.9 49.27,5.94 50.75,5.94 52.93,8.13 63.2,8.13 63.86,7.47 64.73,7.47 RN4.8 | v26.06,3.6 23.79,5.14 23.77,7.77 23.77,10.15 MOS8.1
  Bottom 0.254: v47.31,5.22 47.15,5.22 44.61,3.44 v26.06,3.6
EN8R
  Top 0.152: 69.44,8.08 SHIFT2.7
  Top 0.254: SHIFT2.7 67.87,8.13 67.21,7.47 66.02,7.47 RN4.1
ENCLK  (via drill 0.35)
  Top 0.152: v79.25,8.74 75.35,8.74 SHIFT2.11
  Bottom 0.152: TEENSY_3.6.17/A3 98.22,51.44 96.32,50.29 96.32,42.37 91.59,38.1 88.7,38.1 87.17,36.88 87.17,16 83.67,8.74 v79.25,8.74
ENDATA  (via drill 0.35)
  Top 0.152: v82.14,10.67 75.35,10.67 SHIFT2.14
  Bottom 0.152: TEENSY_3.6.19/A5 98.27,56.52 95.25,53.8 95.25,42.82 90.98,39.17 88.39,39.17 86.26,37.19 86.28,16 83.52,10.67 v82.14,10.67
ENLATCH  (via drill 0.35)
  Top 0.152: v80.7,9.68 76.43,9.68 76.2,9.45 75.41,9.45 SHIFT2.12
  Bottom 0.152: TEENSY_3.6.18/A4 98.17,53.98 95.78,51.82 95.78,42.52 91.19,38.53 88.54,38.56 86.72,37.03 86.72,16 86.66,15.76 83.59,9.68 v80.7,9.68
GND  (via drill 0.35, 0.65)
  Top 0.152: CLK-CLK.10 62.79,54.87 v62.94,54.86 | DATA-CLK.10 69.47,48.59 v69.22,48.9 | 72.75,36.63 SHIFT1.13 73.16,36.58 73.46,36.88 73.46,39.62 72.54,40.54 72.54,40.69 v72.09,41.15
  Top 0.254: SHIFT2.13 72.97,10.03 v72.85,9.91 72.09,9.14 71.78,9.14 71.78,7.62 71.59,7.43 SHIFT2.8 | NAND.7 64.74,22.83 v65.08,23.16 | IC6.7 69.32,39.14 v69.34,39.17 | SHIFT1.8 77.91,40.81 v77.88,40.84 | OCTODATA.10 78.33,24.23 v78.64,24.99 | DATA-DATA.10 69.47,31.42 v68.73,32.16 | CLK-DATA.10 61.49,40.39 61.49,40.62 v60.96,41.15 | WIZNET820IO.J2.4 80.21,68.02 v80.77,68.58 | OCTOCLK.10 76.96,55.62 v78.33,57
  Top 1.27: v22.1,3.2 22.07,3.23 J5.BLACK 15.88,3.23 v15.85,3.2
  Bottom 0.254: v69.19,33.68 69.19,33.22 68.73,32.77 v68.73,32.16
  Bottom 1.27: v22.1,3.2 22.07,3.23 J5.BLACK 15.88,3.23 v15.85,3.2
  other vias: 68.73,40.69 66.14,74.98 70.26,74.98 66.14,62.33 70.41,62.33 65.68,35.2 65.53,32.16 80.77,73 80.77,70.56 74.07,49.68 78.64,29.87 76.2,23.16 70.1,14.48 75.9,15.7 80.62,17.83 44.71,78.35 44.71,56.41 45.2,35.61 44.87,13.83 37.64,8.84 4.42,18.59 88.24,65.38 88.24,64.47 88.24,63.55 88.24,62.64 88.24,61.57 89.31,61.26 90.37,61.26 91.44,61.26 92.51,61.26 93.73,61.42 93.73,62.48 93.73,63.55 93.73,64.47 93.73,65.38 92.81,65.38 91.9,65.38 90.98,65.38 90.07,65.38 89.15,65.38 4.42,24.08 7.32,84.12 23.01,84.12 12.34,69.49 12.19,62.64 12.34,53.49 12.19,43.59 12.19,25.91
  pour Top (isolate 0.305): -3.96,88.24 103.02,88.24 104.55,86.72 104.55,-0.3 102.11,-2.74 -1.37,-2.74 -5.64,1.52 -5.64,86.56
  pour Bottom (isolate 0.305): -2.29,89.92 100.89,89.92 106.38,84.43 106.38,0.91 100.13,-5.33 -0.3,-5.33 -5.94,0.3 -5.94,86.26
LATCHCLK  (via drill 0.35)
  Top 0.152: SHIFT1.12 71.95,37.34 70.59,37.34 v70.79,37.44 | R1.2 v63.7,15.09
  Bottom 0.152: v70.79,37.44 70.23,37.19 69.49,37.19 69.19,36.88 69.19,34.75 69.95,33.99 69.95,33.22 69.34,32.61 69.34,18.59 69.19,18.44 68.28,18.44 66.75,19.96 65.53,19.96 63.7,18.14 v63.7,15.09
LATCHCLKR  (via drill 0.35)
  Top 0.152: NAND.11 60.66,19.96 v60.96,19.66 | R1.1 v58.83,15.09
  Bottom 0.152: v58.83,15.09 58.83,15.54 60.96,17.68 v60.96,19.66
LEDCLK  (via drill 0.35)
  Top 0.152: NAND.13 60.4,18.69 61.57,17.53 66.75,17.53 68.12,18.9 v68.12,19.51 | CLK-CLK.2 62.5,49.67 v62.79,49.38 | CLK-DATA.9 62.45,38.98 v62.79,39.32 64.31,39.32 64.33,39.3 | v68.02,35.59 66.98,36.65 64.33,39.3 | R3.1 65.41,40.39 64.33,39.3
  Top 0.254: NAND.12 NAND.13 | CLK-CLK.2 CLK-CLK.3 CLK-CLK.4 CLK-CLK.5 CLK-CLK.6 CLK-CLK.7 CLK-CLK.8 CLK-CLK.9 | CLK-DATA.9 CLK-DATA.8 CLK-DATA.7 CLK-DATA.6 CLK-DATA.5 CLK-DATA.4 CLK-DATA.3 CLK-DATA.2
  Bottom 0.152: v68.02,35.59 68.12,35.64 v68.12,19.51 | v62.79,49.38 v62.79,39.32
LEDCLKR
  Top 0.152: IC6.5 68.5,36.96 67.36,38.1 67.36,40.17 R3.2
MISO0  (via drill 0.35)
  Top 0.152: v74.37,53.95 74.37,54.41 78.18,58.22 78.79,58.22 79.7,59.13 79.7,60.66 78.94,61.42 78.94,62.92 WIZNET820IO.J2.6
  Bottom 0.152: TEENSY_3.6.12 79.88,41.28 75.74,45.42 75.74,53.34 75.13,53.95 v74.37,53.95
MOSI0
  Bottom 0.152: TEENSY_3.6.11 78.41,43.82 76.2,46.02 76.2,69.34 74.83,70.71 58.8,70.71 WIZNET820IO.J1.3
N$8
  Bottom 0.152: H2.2 53.95,80.16 82.45,80.16 84.89,78.49 84.89,73.51 TEENSY_3.6.0
N$9
  Bottom 0.152: H2.1 82.45,81.99 85.95,80.01 85.95,72.03 TEENSY_3.6.1
OCTO1
  Top 0.152: OCTOCLK.9 80.91,54.42 | 80.91,54.42 81.53,53.8 81.53,21.03 79.55,19.05 78.37,19.05 OCTODATA.2 | 80.91,54.42 80.92,65.38 82.45,66.75 TEENSY_3.6.2
OCTO2  (via drill 0.35)
  Top 0.152: OCTODATA.3 78.33,19.66 79.25,19.66 81.23,21.64 81.23,53.19 v80.62,53.8 v80.62,53.79 76.98,53.79 OCTOCLK.8 | v90.37,52.73 90.37,46.94 92.05,45.26 96.62,45.26 98.07,43.82 TEENSY_3.6.14/A0
  Bottom 0.152: v80.62,53.8 81.67,52.75 82.09,52.74 82.11,52.73 v90.37,52.73
OCTO3  (via drill 0.35)
  Top 0.152: OCTODATA.4 78.37,20.27 79.1,20.27 80.92,22.1 80.92,52.73 80.53,53.12 v79.86,53.19 OCTOCLK.7
  Bottom 0.152: v79.86,53.19 79.86,54.1 80.62,55.02 81.99,55.02 TEENSY_3.6.7
OCTO4  (via drill 0.35)
  Top 0.152: OCTODATA.5 78.4,20.88 79.1,20.88 80.62,22.4 80.62,51.97 80.12,52.47 v79.12,52.48 OCTOCLK.6
  Bottom 0.152: TEENSY_3.6.8 81.99,52.43 v79.12,52.48
OCTO5/RST  (via drill 0.35)
  Top 0.152: OCTOCLK.5 v78.33,51.82 79.85,51.82 80.31,51.36 80.31,22.71 79.25,21.64 78.36,21.64 OCTODATA.6 76.78,21.61 v76.2,21.03 | IC6.2 70.1,35.05 70.87,35.81 v70.84,36.5
  Bottom 0.152: v78.33,51.82 78.33,53.34 80.9,56.52 TEENSY_3.6.6 | v70.84,36.5 70.54,33.19 69.95,32.61 69.95,31.97 69.84,31.85 69.83,31.84 69.83,31.83 69.83,31.71 69.82,31.6 69.82,31.59 69.8,26.34 69.8,26.21 69.8,26.09 69.8,24.54 72.7,24.54 v76.2,21.03
OCTO6/SCK1  (via drill 0.35)
  Top 0.152: OCTOCLK.4 78.83,51.17 v79.1,50.75 80.01,49.53 80.01,23.01 79.25,22.25 78.34,22.25 OCTODATA.7 75.73,22.26 74.98,23.01 74.98,24.38 v73.61,25.76 | R11.1 93.97,47.16 92.81,48.31 v92.81,50.14 | v70.1,40.08 70.56,39.62 70.56,38.4 70.94,38.4 71.03,38.4 71.48,37.95 72.19,37.95 SHIFT1.11 | IC6.1 69.83,34.42 70.26,33.99 70.26,32.66 v70.66,32.16
  Bottom 0.152: v79.1,50.75 79.7,50.14 v92.81,50.14 | v70.1,40.08 70.1,39.17 71.93,37.49 71.93,34.75 71.02,33.68 70.87,32.77 v70.66,32.16 70.13,31.7 70.1,26.21 70.56,25.76 v73.61,25.76
OCTO7/MOSI1  (via drill 0.35)
  Top 0.152: OCTODATA.8 79.27,22.91 79.7,23.32 79.7,48.46 v78.79,49.68 78.26,50.52 OCTOCLK.3 75.36,50.52 v74.83,51.05 | R26.2 92.2,51.82 91.44,51.05 v91.44,47.7 | SHIFT1.14 72.29,35.97 73.3,35.97 73.91,36.58 73.91,38.86 74.52,39.47 74.52,41.76 74.98,42.21 v77.72,42.21
  Bottom 0.152: v78.79,49.68 80.47,47.55 v91.44,47.7 | v74.83,51.05 75.29,50.6 75.29,45.11 77.72,42.67 v77.72,42.21
OCTO8  (via drill 0.35)
  Top 0.152: OCTOCLK.2 77.69,49.87 v78.49,48.62 79.4,47.4 79.4,23.93 79.1,23.62 78.39,23.62 OCTODATA.9
  Bottom 0.152: v78.49,48.62 77.72,49.83 77.72,54.1 81.53,58.98 TEENSY_3.6.5
OCTOEN  (via drill 0.35)
  Top 0.152: NAND.1 66.22,18.06 67.21,19.05 v67.06,21.03 67.89,20.93 69.89,18.98 70.98,19.01 v71.02,19.05 72.45,19.05 | TEENSY_3.6.23/A9 98.07,66.68 96.32,64.92 96.32,61.26 88.85,53.95 v88.85,41.61
  Top 0.254: NAND.5 63.73,20.6 62.79,20.57 62.03,20.12 62.03,18.59 62.94,18.14 64.67,18.14 NAND.1 | 72.45,19.05 OCTODATA.19 | v69.65,50.14 69.92,49.87 OCTOCLK.19
  Bottom 0.152: v71.02,19.05 71.02,17.68 75.29,13.41 83.34,13.41 84.43,15.39 84.43,38.25 87.94,41.45 88.7,41.45 v88.85,41.61
  Bottom 0.254: v67.06,21.03 67.21,48.31 69.04,49.83 v69.65,50.14
RESET
  Top 0.152: TEENSY_3.6.9 84.71,48.9 85.5,49.68 85.5,67.21 84.73,67.97 81.46,67.97 WIZNET820IO.J2.5
SCK0  (via drill 0.35)
  Top 0.152: WIZNET820IO.J1.4 73.41,68.02 74.22,67.21 76.5,67.21 78.64,69.34 80.92,69.34 81.99,70.41 83.52,70.41 86.56,67.36 86.56,43.89 v85.65,42.98 | v91.59,42.98 96.67,42.98 TEENSY_3.6.13
  Bottom 0.152: v85.65,42.98 v91.59,42.98
SHIFT1RI
  Top 0.152: 72.03,35.36 SHIFT1.15 73.53,35.28 74.07,34.75 74.07,29.72 74.22,29.57 75.13,29.57 75.44,29.26 75.44,26.67 75.59,26.52 76.04,26.52 RN1.1
SHIFT1RO  (via drill 0.35)
  Top 0.152: DATA-CLK.9 71.28,47.31 v71.4,47.19 | DATA-DATA.2 72.35,25.87 v73.46,26.67 74.22,26.67 74.35,26.54 RN1.8
  Bottom 0.152: v73.46,26.67 74.22,27.74 74.22,30.51 75.44,31.73 75.44,32.46 76.81,33.83 76.81,42.67 72.24,47.24 71.45,47.24 v71.4,47.19
SHIFT2RI
  Top 0.152: SHIFT1.1 77.15,34.63 76.81,34.29 76.81,29.54 76.96,29.39 76.96,27.58 76.66,27.28 76.12,27.28 RN1.2
SHIFT2RO  (via drill 0.35)
  Top 0.152: 69.47,26.52 DATA-DATA.3 70.71,26.52 v70.74,26.49 70.76,26.52 71.93,26.52 72.75,27.34 RN1.7 | DATA-CLK.8 v70.74,46.63
  Bottom 0.152: 75.13,32.87 75.13,33.07 75.29,33.07 76.5,34.29 76.5,42.37 72.24,46.63 71.66,46.63 71.64,46.61 71.16,46.61 71.15,46.62 v70.74,46.63 | 75.13,32.87 | 75.13,32.87 75.13,31.85 73.91,30.63 73.91,28.04 72.39,26.52 70.76,26.52 v70.74,26.49
SHIFT3RI
  Top 0.152: SHIFT1.2 76.73,35.28 76.5,35.05 76.5,29.41 76.66,29.26 76.66,28.19 76.12,28.19 RN1.3
SHIFT3RO  (via drill 0.35)
  Top 0.152: DATA-CLK.7 71.31,46.01 v71.48,46.02 | DATA-DATA.4 71.67,27.17 v71.75,27.25 71.78,27.28 72.24,27.28 72.7,27.74 73.76,27.74 74.16,28.14 RN1.6
  Bottom 0.152: 74.83,32.74 | 74.83,32.74 74.83,32 73.61,30.78 73.61,28.5 72.24,27.13 71.88,27.13 v71.75,27.25 | v71.48,46.02 72.24,46.02 76.1,42.16 76.1,36.13 75.62,35.66 75.29,35.66 74.83,35.2 74.83,32.74
SHIFT4RI
  Top 0.152: SHIFT1.3 76.77,35.93 76.2,35.36 76.2,29.07 RN1.4
SHIFT4RO  (via drill 0.35)
  Top 0.152: DATA-CLK.6 v70.76,45.31 | DATA-DATA.5 70.68,27.82 v70.74,27.76 70.87,27.89 71.93,27.89 71.99,27.94 72,27.94 72.09,28.04 73.46,28.04 74.35,28.94 RN1.5
  Bottom 0.152: 74.52,32.61 | 74.52,32.61 74.52,32.31 73.15,30.94 73.15,28.8 72.24,27.89 70.87,27.89 v70.74,27.76 | v70.76,45.31 72.39,45.26 75.74,41.91 75.74,36.88 75.44,36.58 75.13,36.58 74.52,35.97 74.52,32.61
SHIFT5RI
  Top 0.152: RN2.1 75.46,30.19 75.89,30.63 75.89,35.81 76.66,36.58 SHIFT1.4
SHIFT5RO  (via drill 0.35)
  Top 0.152: DATA-CLK.5 71.45,44.71 v71.48,44.68 | DATA-DATA.6 71.7,28.47 v71.75,28.52 71.78,28.5 73,28.5 73.44,28.94 RN2.8
  Bottom 0.152: v71.75,28.52 72.11,28.88 72.13,28.88 72.21,28.96 72.39,28.96 72.85,29.41 72.85,31.09 73.98,32.22 73.98,32.25 74.22,32.49 74.22,36.27 75.44,37.49 75.44,41.45 72.24,44.65 71.5,44.65 v71.48,44.68
SHIFT6RI
  Top 0.152: RN2.2 75.19,30.99 75.59,31.39 75.59,35.97 76.81,37.19 77.81,37.19 SHIFT1.5
SHIFT6RO  (via drill 0.35)
  Top 0.152: DATA-CLK.4 70.6,44.06 v70.76,44.04 | 70.66,29.12 DATA-DATA.7 | 70.66,29.12 70.7,29.12 v70.74,29.16 | RN2.7 73.06,30.99 72.85,30.78 72.85,29.41 72.54,29.11 70.67,29.11 70.66,29.12
  Bottom 0.152: v70.74,29.16 70.77,29.19 72.01,29.19 72.08,29.26 72.09,29.26 72.45,29.63 72.45,31.18 73.43,32.16 73.46,32.16 73.91,32.61 73.91,37.64 74.37,38.1 74.52,38.1 74.98,38.56 74.98,41.15 72.09,44.04 v70.76,44.04
SHIFT7RI
  Top 0.152: RN2.3 74.79,31.79 75.25,32.25 75.25,32.27 75.29,32.31 75.29,36.42 76.66,37.8 77.77,37.8 SHIFT1.6
SHIFT7RO  (via drill 0.35)
  Top 0.152: DATA-CLK.3 71.5,43.41 v71.53,43.38 | DATA-DATA.8 71.73,29.77 v71.75,29.79 72.39,30.43 72.39,31.24 72.94,31.79 RN2.6
  Bottom 0.152: v71.75,29.79 71.78,29.82 71.78,30.94 73.61,32.77 73.61,38.4 73.91,38.4 74.37,38.86 74.37,41.15 72.09,43.43 71.58,43.43 v71.53,43.38
SHIFT8RI
  Top 0.152: 77.88,38.56 SHIFT1.7 77.73,38.4 76.81,38.4 74.69,36.29 RN2.4
SHIFT8RO  (via drill 0.35)
  Top 0.152: DATA-CLK.2 70.63,42.76 v70.81,42.72 | DATA-DATA.9 70.73,30.42 v70.74,30.43 72.9,32.59 RN2.5
  Bottom 0.152: v70.74,30.43 73.3,32.99 73.3,39.17 v73.69,40.26 73.76,40.84 71.93,42.67 70.87,42.67 v70.81,42.72
SOURCE1
  Top 1.27: MOS1.2 23.67,81.13 26.67,84.12 28.32,84.12 F1.1
SOURCE2
  Top 1.27: MOS2.2 24.36,67.95 26.21,69.8 F2.1
SOURCE3
  Top 1.27: MOS3.2 25.34,59.18 25.45,59.28 25.45,61.11 27.13,62.79 28.35,62.79 F3.1
SOURCE4
  Top 1.27: F4.1 25.44,48.52 25.44,48.63 MOS4.2
SOURCE5
  Top 1.27: MOS5.2 28.29,41.46 F5.1
SOURCE6
  Top 1.27: MOS6.2 23.67,31.79 F6.1
SOURCE7
  Top 1.27: MOS7.2 24.55,23.75 25.53,22.77 25.53,20.5 26.35,19.68 28.31,19.68 F7.1
SOURCE8
  Top 1.27: F8.1 25.34,6.62 25.31,11.53 23.63,12.41 MOS8.2
SPI1EN  (via drill 0.35)
  Top 0.152: v55.17,46.48 55.17,46.94 54.56,47.4 54.56,49.23 55.02,49.68 55.77,49.68 CLK-CLK.19 | DATA-DATA.19 62.47,25.87 v62.38,25.86
  Top 0.254: NAND.4 NAND.3 63.04,19.33 v62.99,19.38
  Bottom 0.152: 62.64,19.74 62.46,25.84 v62.38,25.86 | 62.99,19.41 v62.99,19.38 62.64,19.74 | 62.64,19.74 61.49,20.88 60.66,20.88 58.52,18.75 56.69,18.75 56.24,19.2 56.24,25.12 55.02,26.34 55.02,28.65 52.43,31.24 52.43,33.81 54.71,36.09 54.71,46.02 v55.17,46.48
SPI2EN  (via drill 0.35)
  Top 0.152: v54.41,34.14 54.56,34.14 54.86,34.44 55.64,34.44 CLK-DATA.19 | v59.89,24.69 58.83,24.69 57.45,26.06 56.39,26.06 v55.78,26.67 | DATA-CLK.19 61.99,42.76 v61.98,42.82
  Top 0.254: NAND.6 62.03,21.23 v61.98,21.29
  Bottom 0.152: v59.89,24.69 61.98,24.69 61.98,25.04 61.77,25.35 61.72,42.52 v61.98,42.82 | v54.41,34.14 53.19,34.14 52.73,33.68 52.73,31.7 54.56,29.87 54.86,29.87 55.78,28.96 v55.78,26.67
  Bottom 0.254: v61.98,21.29 61.98,24.69
SPI_SW  (via drill 0.35)
  Top 0.152: NAND.2 65.79,18.69 v66.14,19.05 | TEENSY_3.6.22/A8 97.97,64.14 96.77,62.94 96.77,61.11 89.61,53.95 89.61,52.96 | 89.61,52.96 89.61,53.34 | 89.61,52.96 v89.61,40.92
  Bottom 0.152: v66.14,19.05 67.67,17.53 69.95,17.53 74.37,13.11 83.52,13.11 84.73,15.32 84.73,38.1 87.82,40.92 v89.61,40.92
SS  (via drill 0.35)
  Top 0.152: WIZNET820IO.J1.5 76.71,65.48 77.27,64.92 77.27,60.66 v78.49,59.44
  Bottom 0.152: TEENSY_3.6.10 79.89,46.36 77.88,48.36 77.88,48.92 76.96,49.83 76.96,57.91 v78.49,59.44
VCC  (via drill 0.35, 0.65)
  Top 0.152: CLK-DATA.1 62.58,33.78 63.25,34.44 63.86,34.44 IC6.14 | 64.16,42.06 63.68,42.06 DATA-CLK.20 DATA-CLK.1 | DATA-DATA.1 73.08,25.22 74.52,23.77 74.52,18.9 73.91,18.29 72.69,18.29 OCTODATA.20 72.57,18.29 73,18.29 | SHIFT1.16 72.77,33.91 72.7,33.07 70.71,31.09 68.73,33.07 63.86,33.07 v63.55,32.77
  Top 0.254: CLK-DATA.20 55.63,33.75 56.24,32.92 56.25,31.69 61.19,26.29 61.72,25.76 61.72,25.3 | 72.42,18.29 OCTODATA.20 | NAND.14 58.6,18.06 | OCTODATA.20 70.02,18.36 68.58,16.92 59.74,16.92 58.6,18.06 | OCTODATA.20 72.5,18.03 73,17.53 77.5,17.53 77.72,17.75 | 77.72,17.75 OCTODATA.1 | 61.72,25.3 61.87,25.15 63.56,25.15 DATA-DATA.20 63.63,24.01 v63.55,23.93 | 58.6,18.06 58.06,18.42 58.06,22.25 58.98,23.01 60.96,23.01 61.72,23.77 61.72,25.3 | SHIFT2.10 76.81,8.08 v77.72,7.16 | SHIFT2.16 76.94,11.96 v77.72,11.43 77.72,17.75 | OCTOCLK.1 76.96,49.22 v76.96,48.16 | v76.96,48.16 76.81,48.31 | OCTOCLK.20 71.12,48.87 71.63,48.16 v76.96,48.16 | 69.51,42.06 DATA-CLK.1 70.93,40.65 70.93,38.92 71.09,38.75 SHIFT1.10 | v63.55,41 63.63,41.08 DATA-CLK.20 63.86,42.11 60.81,42.11 v58.22,44.65 55.78,47.09 CLK-CLK.20 | IC6.14 63.88,33.1 v63.55,32.77 | C6.1 v79.86,11.43 | IC7.14 50.11,51.33 v50.72,50.72 | IC9.14 49.95,8.11 v50.87,7.64 | IC8.14 49.86,28.55 v49.88,28.53 | H3.1 51.21,71.52 v51.18,73.53 50.49,74.22 50.14,74.22 49.86,73.94 IC5.14 | C5.1 2.34,61.32 2.29,61.27 | C4.1 2.39,70.26 2.29,70.16 | C11.1 2.35,16.97 2.29,16.92 | C10.1 2.3,25.91 2.29,25.92 | C9.1 2.4,34.75 2.29,34.64 | C8.1 2.3,43.59 2.29,43.59 | C7.1 2.46,52.43 2.29,52.26 | C12.1 6.25,7.61 6.17,8.45
  Top 0.406: CLK-CLK.1 61.57,48.97 v61.57,48.31 | U$1.1 93.38,69.63 C2.1 C1.1 93.46,74.3 TEENSY_3.6.VIN
  Top 2.54: J5.RED 11.12,3.34 11.12,6.25 9.68,7.69 6.17,8.45 3.73,8.45 2.29,10.19 2.29,16.92 2.29,25.92 2.29,34.64 2.29,43.59 2.29,52.26 2.29,61.27 2.29,70.16 2.29,74.51 LED1.1 2.21,76.42 7.92,80.01 v17.07,80.01 v18.75,80.01 v20.95,80.01
  Bottom 0.152: 63.55,25.91 63.55,25.92
  Bottom 0.254: 76.96,49.23 v76.96,48.16 76.96,46.79 78.64,45.11 94.49,45.23 | v63.55,41 v63.55,32.77 63.55,25.92 | v63.55,23.93 63.55,25.91 | v49.88,28.53 49.16,29.26 45.11,29.26 44.04,30.33 39,30.33 38.98,30.31 | v51.18,73.53 45.34,73.53 43.89,73.15 41.65,73.15 J1.1
  Bottom 0.406: TEENSY_3.6.VIN 98.3,74.22 97.84,74.22 96.16,72.69 96.16,61.37 92.2,57.4 92.2,53.8 94.49,51.51 94.49,45.23 94.49,43.89 93.59,43.89 89.91,40.21 87.76,40.21 85.34,37.8 85.34,15.54 85.2,15.27 85.2,15.26 85.17,15.21 85.17,15.14 85.09,15.06 83.82,12.65 82.6,11.43 v79.86,11.43 v77.72,11.43 v77.72,7.16 77.11,6.55 60.96,6.55 60.03,7.64 v50.87,7.64 44.79,7.64 44.2,8.23 41.61,8.23 J4.1 | v61.57,48.31 58.22,44.96 v58.22,44.65 | v50.72,50.72 49.56,50.72 48.92,51.36 38.96,51.36 38.93,51.39
  Bottom 2.54: J5.RED 10.93,6.43 2.29,9.12 2.29,12.43 LED8.1 LED7.1 LED6.1 LED5.1 LED4.1 LED3.1 LED2.1 LED1.1 2.21,76.42 7.92,80.01 v17.07,80.01 v18.75,80.01 v20.95,80.01 22.25,80.01 24.08,78.03 30.23,78.03 30.41,78.2 30.5,78.2 30.63,78.33 36.43,78.33 | 36.43,78.33 38.86,78.33 38.93,78.27 J1.1 J2.1 38.93,51.39 J3.1 38.98,32.47 38.98,30.31 J4.1 | 36.43,78.33 36.39,78.29 J1.2 J2.2 J3.2 36.44,32.47 J4.2

## Text on the board
tNames: VideoBoy / v1.1